# Altium schematic sheet Schematic.SchDoc.SchDoc
size A4; SheetNumber: 1; SheetTotal: 1
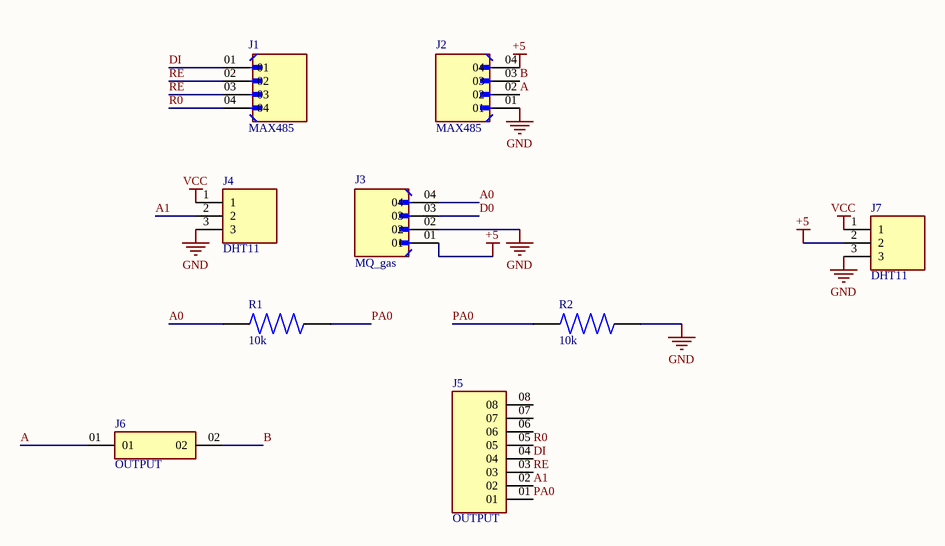
[diagram p0: Schematic.SchDoc.SchDoc]

## Parts
J1  MAX485  [WURTH_61300411121]
J2  MAX485  [WURTH_61300411121]
J3  MQ_gas  [WURTH_61300411121]
J4  DHT11  [TE_644884-3]
J5  OUTPUT  [SAMTEC_TSW-108-X-X-S]
J6  OUTPUT  [SAMTEC_MTSW-101-08-S-D-318]
J7  DHT11  [TE_644884-3]
R1  10k  [RESAD1100W55L680D260]
R2  10k  [RESAD1100W55L680D260]

## Nets
+5: J2.04 J3.01 J7.2
GND: J2.01 J3.02 J4.3 J7.3 R2.2
VCC: J4.1 J7.1
A: J2.02 J6.01
A0: J3.04 R1.1
A1: J4.2 J5.02
B: J2.03 J6.02
D0: J3.03
DI: J1.01 J5.04
PA0: J5.01 R1.2 R2.1
R0: J1.04 J5.05
RE: J1.02 J1.03 J5.03

Not connected (* = marked no-connect by the designer): J5 06 07 08

## Library data of the parts
J1-J3 = 61300411121: Connector Header Through Hole 4 position 0.100 (2.54mm); MF: WÃ¼rth Elektronik; SnapEDA_Link: https://www.snapeda.com/parts/61300411121/W%25C3%25BCrth+Elektronik+Midcom/view-part/?ref=snap; Package: None; Value: *; MP: 61300411121; Check_prices: https://www.snapeda.com/parts/61300411121/W%25C3%25BCrth+Elektronik+Midcom/view-part/?ref=eda
J4 J7 = 644884-3: Conn Unshrouded Header HDR 3 POS 2.54mm Solder ST Thru-Hole Bag/Box; MF: TE Connectivity; SnapEDA_Link: https://www.snapeda.com/parts/644884-3/TE+Connectivity+AMP+Connectors/view-part/?ref=snap; Package: None; Value: *; MP: 644884-3; EU_RoHS_Compliance: Compliant; Check_prices: https://www.snapeda.com/parts/644884-3/TE+Connectivity+AMP+Connectors/view-part/?ref=eda
J5 = TSW-108-X-X-S: Connector Header Through Hole 8 position 0.100 (2.54mm); MF: Samtec; MP: TSW-108-23-L-S; SnapEDA_Link: https://www.snapeda.com/parts/TSW-108-23-L-S/Samtec/view-part/?ref=snap; Package: None; Value: *; Check_prices: https://www.snapeda.com/parts/TSW-108-23-L-S/Samtec/view-part/?ref=eda
J6 = MTSW-101-08-S-D-318: Package: None; Price: None; Value: *; MP: MTSW-101-08-S-D-318; Availability: Unavailable
R1 R2 = MFR-25FBF52-1K: 1.07 kOhms Â±1% 0.25W, 1/4W Through Hole Resistor Axial - Metal Film; MF: Yageo; SnapEDA_Link: https://www.snapeda.com/parts/MFR-25FBF52-1K/Yageo/view-part/?ref=snap; Package: RADIAL-2 YAGEO; Value: *; MP: MFR-25FBF52-1K; Check_prices: https://www.snapeda.com/parts/MFR-25FBF52-1K/Yageo/view-part/?ref=eda